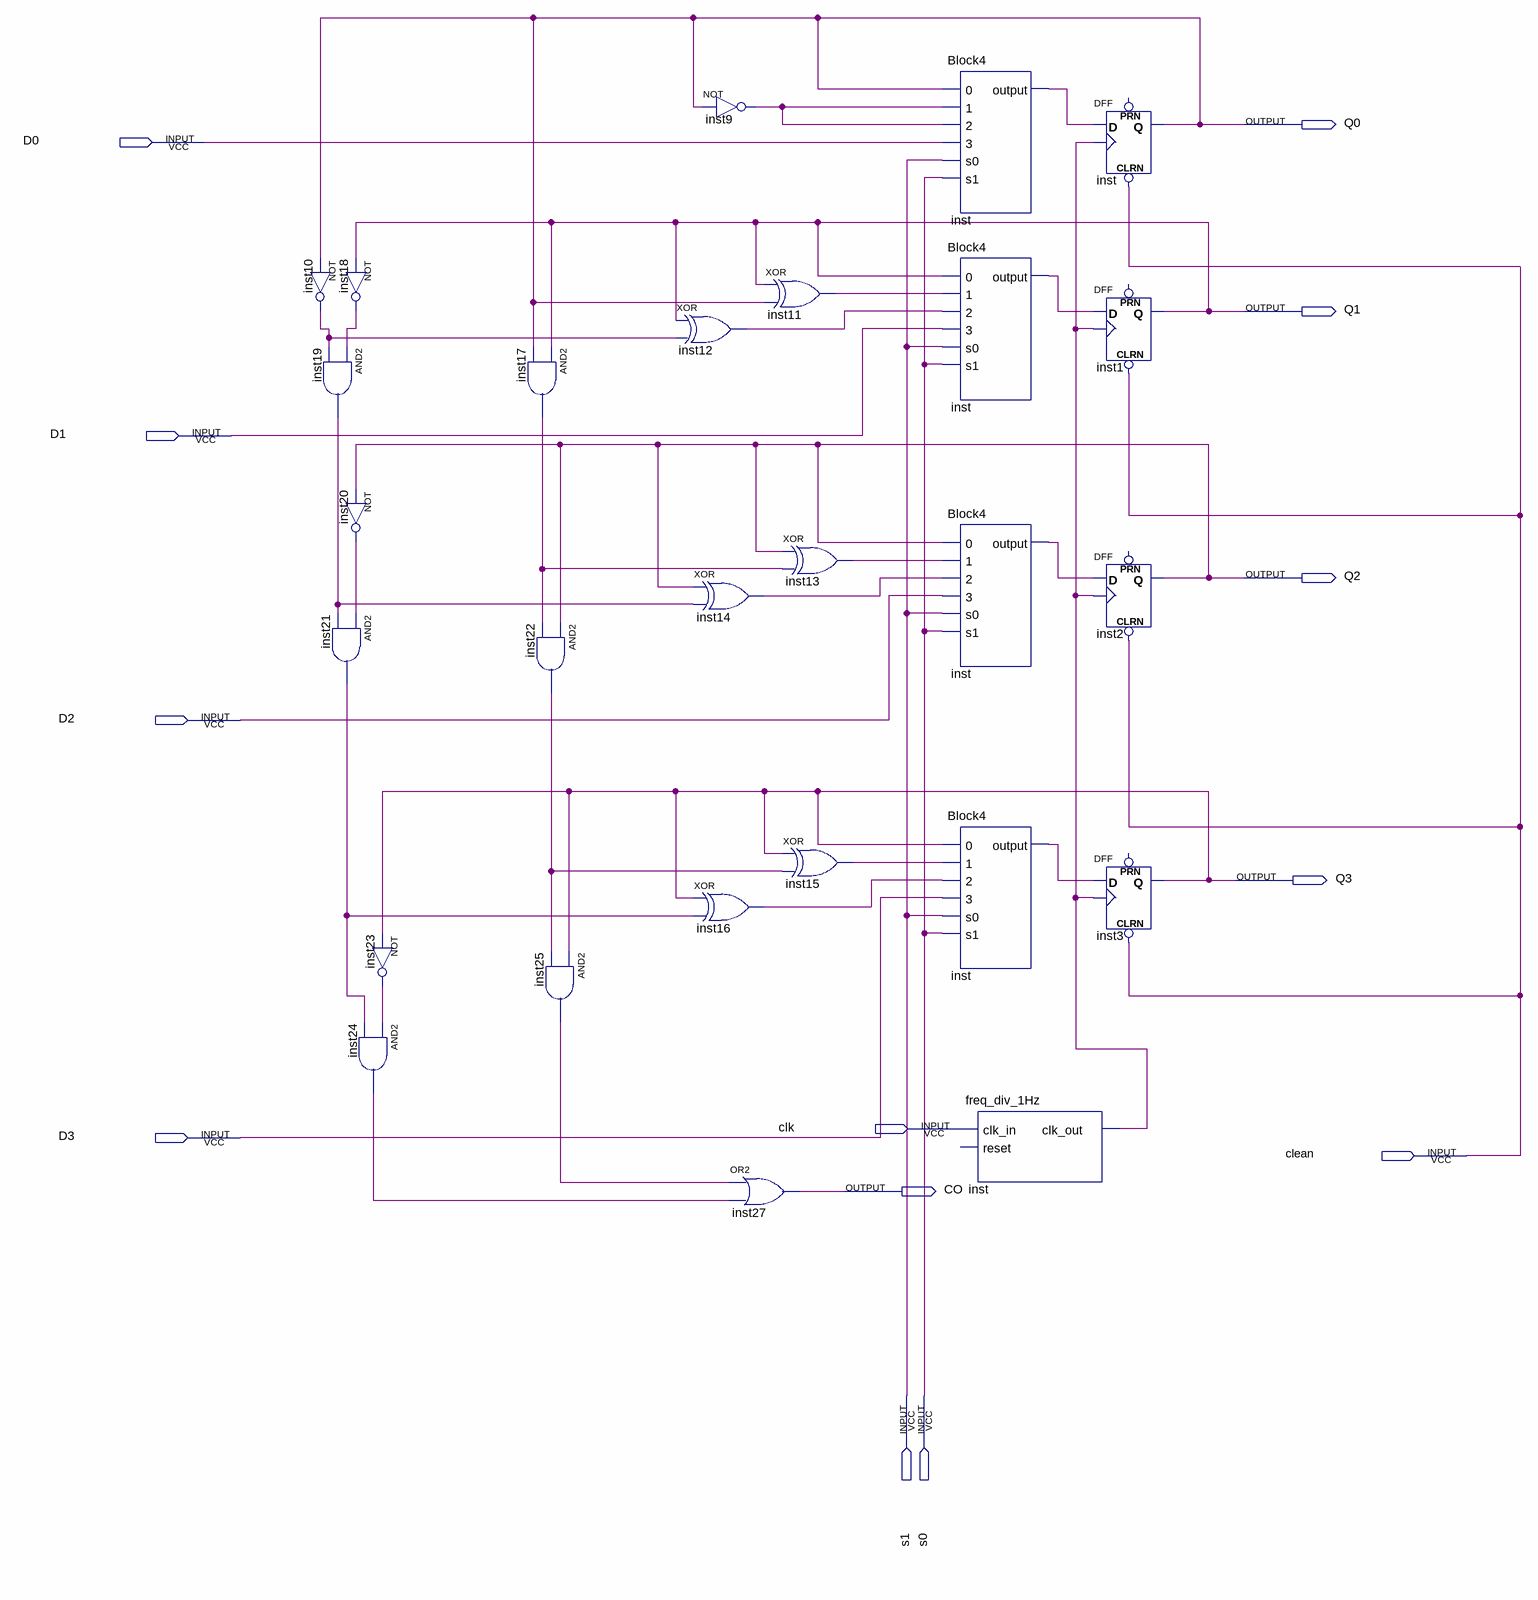
[diagram p0: schematic sheet]
// Quartus schematic Block3.bdf as structural Verilog: 27 symbols, 13 pins
module Block3 (
  input  D0,
  input  D1,
  input  D2,
  input  clk,
  input  D3,
  input  clean,
  input  s1,
  input  s0,
  output Q0,
  output Q1,
  output Q2,
  output Q3,
  output CO
);

  wire inst9_out, inst10_out, inst11_out, inst12_out, inst13_out, inst14_out, inst15_out, inst16_out,
       inst17_out, inst18_out, inst19_out, inst20_out, inst21_out, inst22_out, inst23_out, inst24_out,
       inst25_out, inst_clk_out, inst_output, inst_output_2, inst_output_3, inst_output_4;

  not inst10 (inst10_out, Q0);
  not inst18 (inst18_out, Q1);
  and inst19 (inst19_out, inst18_out, inst10_out);
  not inst20 (inst20_out, Q2);
  and inst21 (inst21_out, inst20_out, inst19_out);
  not inst23 (inst23_out, Q3);
  and inst24 (inst24_out, inst23_out, inst21_out);
  and inst17 (inst17_out, Q1, Q0);
  and inst22 (inst22_out, Q2, inst17_out);
  and inst25 (inst25_out, Q3, inst22_out);
  not inst9 (inst9_out, Q0);
  xor inst12 (inst12_out, Q1, inst10_out);
  xor inst14 (inst14_out, Q2, inst19_out);
  xor inst16 (inst16_out, Q3, inst21_out);
  xor inst11 (inst11_out, Q1, Q0);
  xor inst13 (inst13_out, Q2, inst17_out);
  xor inst15 (inst15_out, Q3, inst22_out);
  or inst27 (CO, inst25_out, inst24_out);
  Block4 inst (.\0 (Q0), .\1 (inst9_out), .\2 (inst9_out), .\3 (D0), .s0(s1), .s1(s0), .\output (inst_output));
  Block4 inst_dup2 (.\0 (Q1), .\1 (inst11_out), .\2 (inst12_out), .\3 (D1), .s0(s1), .s1(s0), .\output (inst_output_2));
  Block4 inst_dup3 (.\0 (Q2), .\1 (inst13_out), .\2 (inst14_out), .\3 (D2), .s0(s1), .s1(s0), .\output (inst_output_3));
  Block4 inst_dup4 (.\0 (Q3), .\1 (inst15_out), .\2 (inst16_out), .\3 (D3), .s0(s1), .s1(s0), .\output (inst_output_4));
  freq_div_1Hz inst_dup5 (.clk_in(clk), .clk_out(inst_clk_out));  // open: reset
  DFF inst_dup6 (.CLRN(clean), .CLK(inst_clk_out), .D(inst_output), .Q(Q0));  // open: PRN
  DFF inst1 (.CLRN(clean), .CLK(inst_clk_out), .D(inst_output_2), .Q(Q1));  // open: PRN
  DFF inst2 (.CLRN(clean), .CLK(inst_clk_out), .D(inst_output_3), .Q(Q2));  // open: PRN
  DFF inst3 (.CLRN(clean), .CLK(inst_clk_out), .D(inst_output_4), .Q(Q3));  // open: PRN
endmodule
